# EAGLE design analog_out_test (EAGLE 9.6.2)
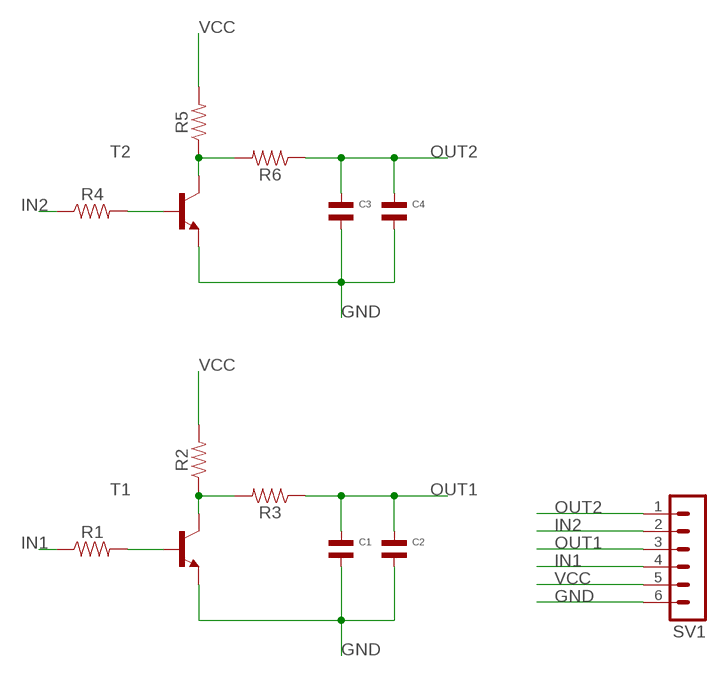
[diagram p0: schematic, sheet 1]

## Parts
C1  CAPACITOR_NP_1206  [C1206]
C2  CAPACITOR_NP_1206  [C1206]
C3  CAPACITOR_NP_1206  [C1206]
C4  CAPACITOR_NP_1206  [C1206]
R1  RESISTOR21206  [1206]
R2  RESISTOR21206  [1206]
R3  RESISTOR21206  [1206]
R4  RESISTOR21206  [1206]
R5  RESISTOR21206  [1206]
R6  RESISTOR21206  [1206]
SV1  MA06-1  [MA06-1]
T1  BC849-NPN-SOT23-BEC  [SOT23-BEC]
T2  BC849-NPN-SOT23-BEC  [SOT23-BEC]

## Nets
GND: C1.P$2 C2.P$2 C3.P$2 C4.P$2 SV1.6 T1.E T2.E
IN1: R1.1 SV1.4
IN2: R4.1 SV1.2
N$1: R2.1 R3.2 T1.C
N$2: R1.2 T1.B
N$3: R4.2 T2.B
N$4: R5.1 R6.2 T2.C
OUT1: C1.P$1 C2.P$1 R3.1 SV1.3
OUT2: C3.P$1 C4.P$1 R6.1 SV1.1
VCC: R2.2 R5.2 SV1.5

## Library data of the parts
C1-C4 = 00jim:CAPACITOR_NP: Library: MF_Passives Description: Device for Non-Polarized Capacitors. Manufacture part number (MPN) can be added via Attributes. Check https://factory.macrofab.com/parts for the house parts list.; POPULATE: 1
R1-R6 = 00jim:RESISTOR2: Generic Resistor Package
SV1 = 00jim:MA06-1: PIN HEADER; OC_FARNELL: unknown; OC_NEWARK: unknown
T1 T2 = transistor-neu-to92:*-NPN-: NPN Transistror

## Board
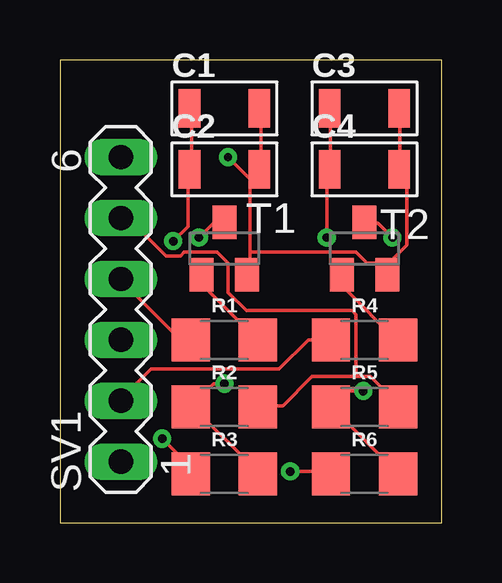
[diagram p1: board, top side]
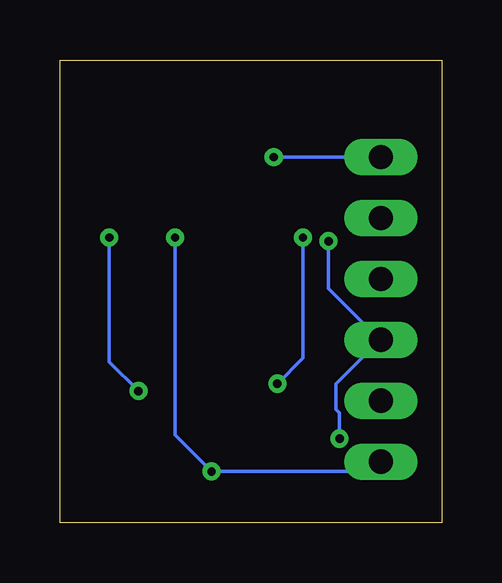
[diagram p2: board, bottom side, seen from below]

Size 15.93 x 19.29 mm. Coordinates in mm from the lower left corner, seen from the top.
Outline: 0,0 15.93,0 15.93,19.29 0,19.29 0,0
Copper layers (1*16): Top 0.035mm / dielectric 1.5mm / Bottom 0.035mm
Design rules "default": minimum track width 6mil, minimum drill 0.35mm, track to track 6mil, track to pad 6mil, pad to pad 6mil, via to via 6mil, smd to smd 6mil, copper to edge 40mil, drill to drill 6mil, minimum pad ring 10mil, minimum via ring 8mil, stop-mask expansion 4mil, vias tented up to drill 0mil, thermal gap 10mil

### Footprints (pad centres in the part's own frame; a part is rotated, then mirrored left to right if it is on the bottom)
C1206 = smd 0.9 x 1.6: P$1 -1.45,0; P$2 1.45,0
1206 = smd 1.6 x 1.8: 1 -1.4,0; 2 1.4,0
MA06-1 = drill 1.016 long: 1 -6.35,0; 2 -3.81,0; 3 -1.27,0; 4 1.27,0; 5 3.81,0; 6 6.35,0
SOT23-BEC = smd 1 x 1.4: B -0.95,-1.1; C 0,1.1; E 0.95,-1.1

### Placement (x,y rotation side)
C1  6.86,17.27 0 top
C2  6.86,14.73 0 top
C3  12.7,17.27 0 top
C4  12.7,14.73 0 top
R1  6.86,7.62 0 top
R2  6.86,4.83 0 top
R3  6.86,2.03 0 top
R4  12.7,7.62 0 top
R5  12.7,4.83 0 top
R6  12.7,2.03 0 top
SV1  2.54,8.89 90 top
T1  6.86,11.43 0 top
T2  12.7,11.43 0 top

### Tracks (layer width: path | path; a pad name or v marks a point on that pad's centre or on a via)
GND  (via drill 0.35)
  Top 0.152: 13.72,10.82 13.72,10.36 T2.E 13.72,10.82 | 13.72,10.82 14.48,11.58 14.48,14.33 14.17,14.63 C4.P$2 14.17,14.78 14.17,17.22 C3.P$2 | 7.92,14.33 7.92,11.28 | 7.92,11.28 7.92,10.36 T1.E | 7.92,14.33 8.23,14.63 C2.P$2 | C1.P$2 8.38,17.22 8.38,14.78 C2.P$2 | 7.92,14.33 v7.01,15.24 | 7.92,14.33 C2.P$2 | 13.72,10.82 12.8,10.82 12.34,11.28 7.92,11.28
  Bottom 0.152: v7.01,15.24 SV1.6
IN1
  Top 0.152: R1.1 5.03,7.62 2.59,10.06 SV1.4
IN2
  Top 0.152: R4.1 10.36,7.62 9.14,6.4 3.81,6.4 2.59,5.18 SV1.2
N$1  (via drill 0.35)
  Top 0.152: v5.79,11.89 6.4,12.5 6.86,12.5 T1.C | v6.86,5.79 6.4,5.79 5.49,4.88 | 5.49,4.88 8.23,2.13 R3.2 | 5.49,4.88 R2.1
  Bottom 0.152: v5.79,11.89 5.79,6.86 v6.86,5.79
N$2
  Top 0.152: T1.B 5.94,10.21 5.94,9.91 8.23,7.62 R1.2
N$3
  Top 0.152: T2.B 11.89,10.21 11.89,9.75 14.02,7.62 R4.2
N$4  (via drill 0.35)
  Top 0.152: v13.87,11.89 13.26,12.5 12.8,12.5 T2.C | v12.65,5.49 12.04,5.49 11.43,4.88 R5.1 11.43,4.72 14.02,2.13 R6.2
  Bottom 0.152: v13.87,11.89 13.87,6.71 v12.65,5.49
OUT1  (via drill 0.35)
  Top 0.152: C1.P$1 5.49,17.22 5.49,14.78 C2.P$1 5.33,14.63 5.33,12.34 v4.72,11.73 | v4.27,3.5 5.33,2.44 5.33,2.13 R3.1
  Bottom 0.152: v4.27,3.5 4.27,4.57 4.42,4.72 4.42,5.79 2.59,7.62 | v4.72,11.73 4.72,9.75 2.59,7.62 | 2.59,7.62 SV1.3
OUT2  (via drill 0.35)
  Top 0.152: C3.P$1 11.28,17.22 11.28,14.78 C4.P$1 11.12,14.63 v11.12,11.89 | v9.6,2.13 11.28,2.13 R6.1
  Bottom 0.152: SV1.1 2.59,2.44 2.9,2.13 v9.6,2.13 11.12,3.66 v11.12,11.89
VCC
  Top 0.152: 12.34,6.1 12.95,6.1 14.17,4.88 R5.2 | 12.34,6.1 10.52,6.1 9.3,4.88 8.38,4.88 R2.2 | 12.34,6.1 12.34,8.69 12.19,8.84 7.77,8.84 7.01,9.6 7.01,10.82 6.55,11.28 5.18,11.28 5.03,11.12 4.42,11.12 2.9,12.65 2.59,12.65 SV1.5